# EAGLE design rpi-zero-psu (EAGLE 7.7.0)
CREVISION: 1A; DESIGNER: Joo Aun Saw
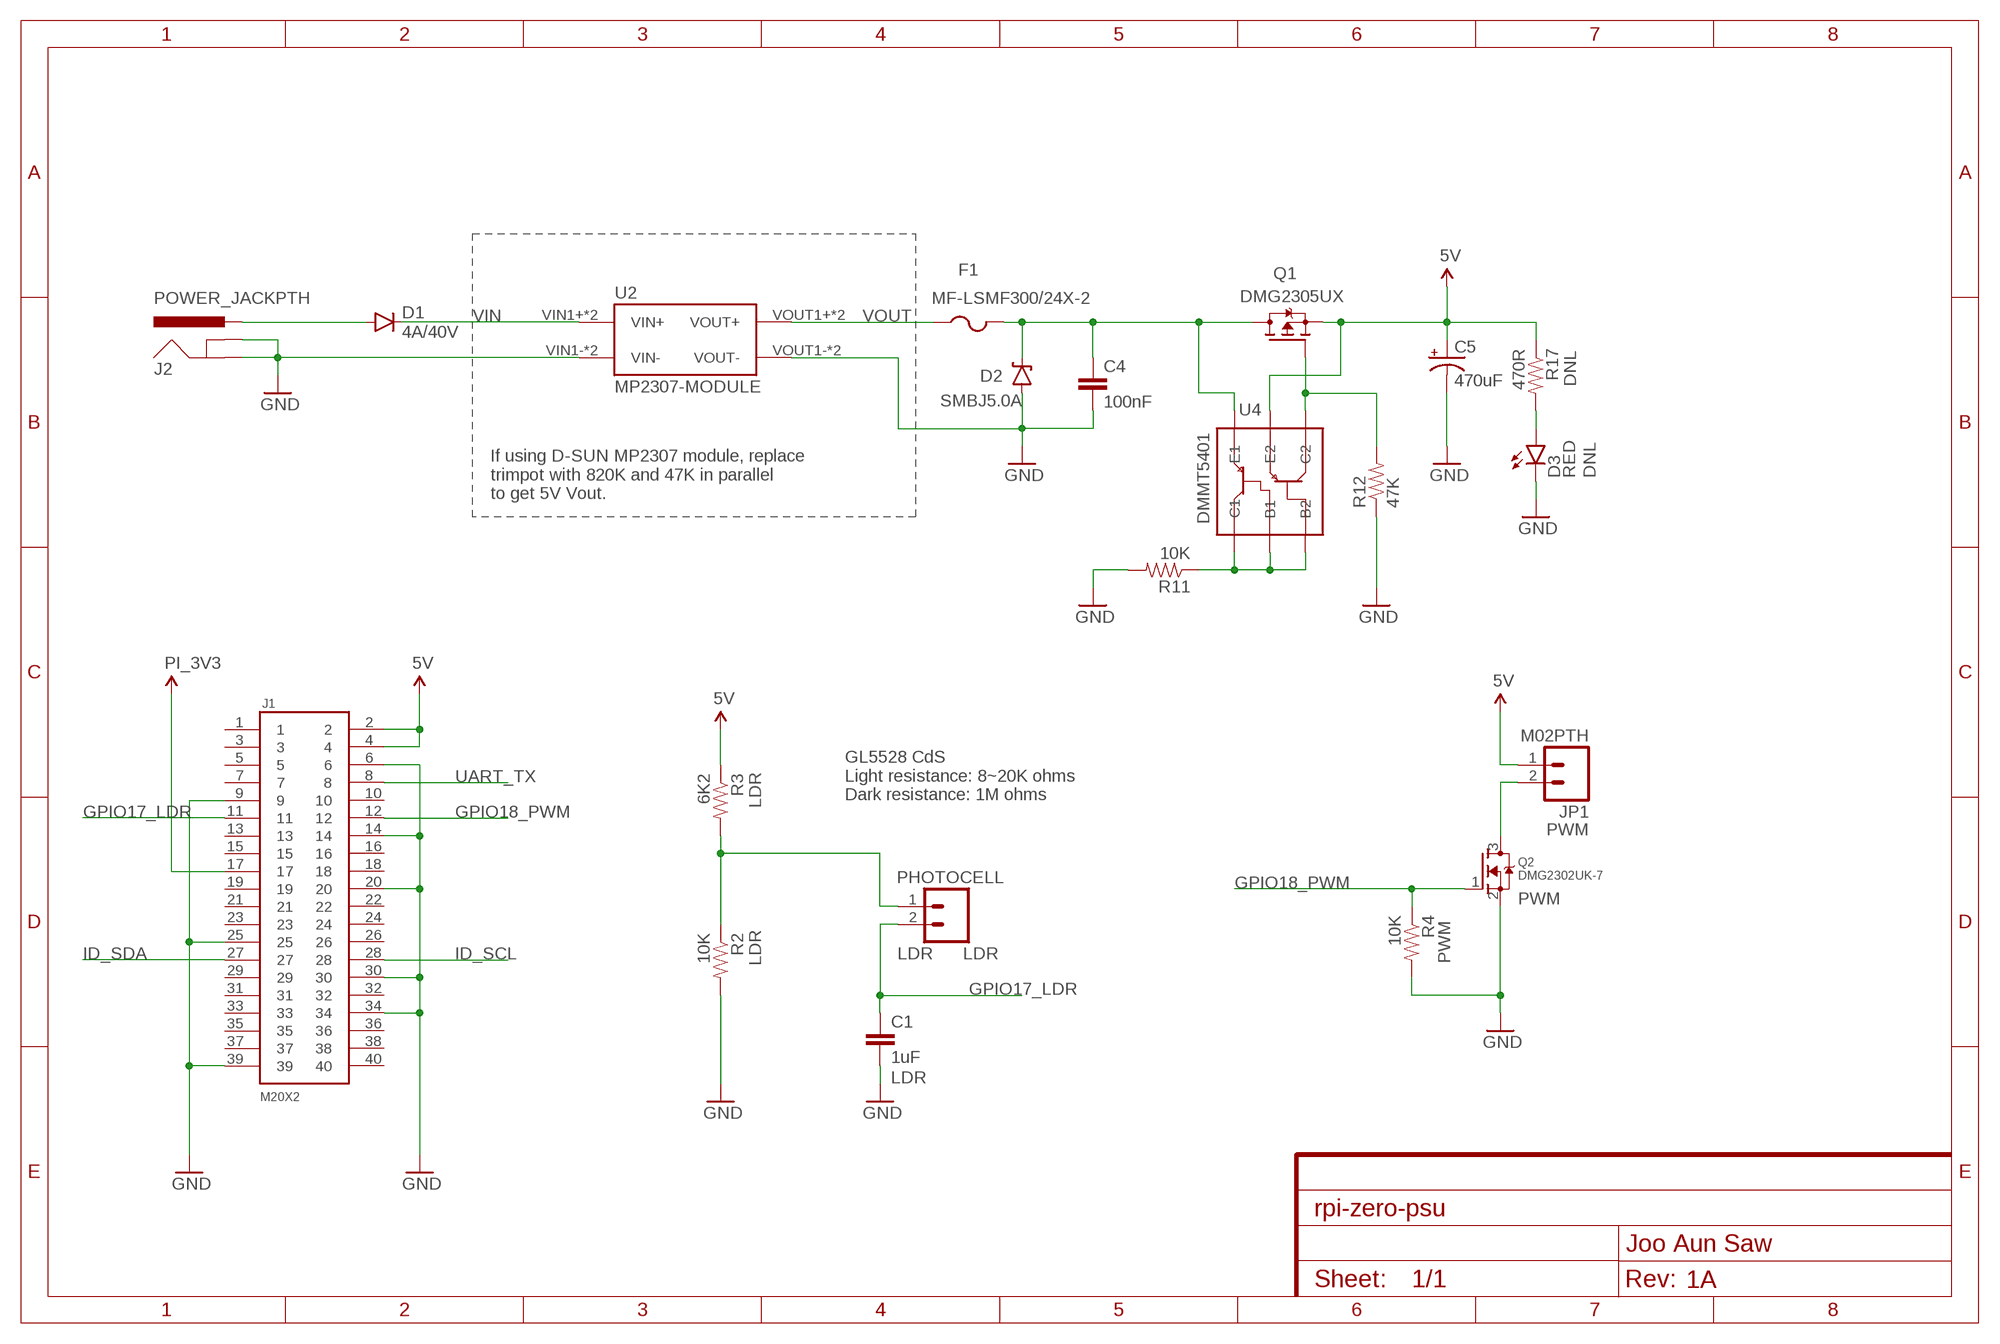
[diagram p0: schematic, sheet 1]

## Parts
C1  1uF  CAP0805  [0805]
C4  100nF  CAP0805  [0805]
C5  470uF  CAP_POLF  [PANASONIC_F]
D1  4A/40V  DIODEES3J  [SMC]
D2  SMBJ5.0A  DIODE-ZENERSMB  [SMB-DIODE]
D3  RED  LED-RED1206  [LED-1206]
F1  MF-LSMF300/24X-2  PTCFUSE-2920  [2920]
J1  M20X2  [2X20]
J2  POWER_JACKPTH  [POWER_JACK_PTH]
JP1  M02PTH  [1X02]
LDR  PHOTOCELL  M021X02_NO_SILK  [1X02_NO_SILK]
Q1  DMG2305UX  MOSFET-P  [SOT-23]
Q2  DMG2302UK-7  MOSFET-NREFLOW  [SOT23]
R2  10K  RESISTOR0805-RES  [0805]
R3  6K2  RESISTOR0805-RES  [0805]
R4  10K  RESISTOR0805-RES  [0805]
R11  10K  RESISTOR0805-RES  [0805]
R12  47K  RESISTOR0805-RES  [0805]
R17  470R  RESISTOR0805-RES  [0805]
U2  MP2307-MODULE  DC-DC-MODULEMP2307-MODULE  [MP1584EN-MODULE]
U4  DMMT5401  DMMT5401SOT  [SOT23-6]

## Nets
3.3V: J1.17 ; supply symbol labelled PI_3V3
5V: C5.+ J1.2 J1.4 JP1.1 Q1.2(S) R3.1 R17.1 U4.5(E2)
GND: C1.2 C4.2 C5.- D2.A D3.C J1.6 J1.9 J1.14 J1.20 J1.25 J1.30 J1.34 J1.39 J2.GND J2.GNDBREAK Q2.2(S) R2.2 R4.2 R11.2 R12.1 U2.VIN1-(VIN-) U2.VIN2-(VIN-) U2.VOUT1-(VOUT-) U2.VOUT2-(VOUT-)
GPIO17_LDR: C1.1 J1.11 LDR.2
GPIO18_PWM: J1.12 Q2.1(G) R4.1
ID_SCL: J1.28
ID_SDA: J1.27
N$1: JP1.2 Q2.3(D)
N$2: LDR.1 R2.1 R3.2
N$3: D3.A R17.2
N$5: D1.A J2.PWR
N$12: C4.1 D2.C F1.2 Q1.3(D) U4.6(E1)
N$13: R11.1 U4.1(C1) U4.2(B1) U4.3(B2)
N$15: Q1.1(G) R12.2 U4.4(C2)
UART_TX: J1.8
VIN: D1.C U2.VIN1+(VIN+) U2.VIN2+(VIN+)
VOUT: F1.1 U2.VOUT1+(VOUT+) U2.VOUT2+(VOUT+)
Unconnected: J1.1 J1.3 J1.5 J1.7 J1.10 J1.13 J1.15 J1.16 J1.18 J1.19 J1.21 J1.22 J1.23 J1.24 J1.26 J1.29 J1.31 J1.32 J1.33 J1.35 J1.36 J1.37 J1.38 J1.40

## Notes on the sheet
- If using D-SUN MP2307 module, replace
  trimpot with 820K and 47K in parallel
  to get 5V Vout.
- GL5528 CdS
  Light resistance: 8~20K ohms
  Dark resistance: 1M ohms

## Library data of the parts
C1 = SparkFun-Passives:CAP: Capacitor Standard 0603 ceramic capacitor, and 0.1" leaded capacitor.; DIGIKEY: 311-1456-1-ND; LDR: 1; MOUSER: 603-CC805KKX7R8BB105; PARTNO: CC0805KKX7R8BB105
C4 = SparkFun-Passives:CAP: Capacitor Standard 0603 ceramic capacitor, and 0.1" leaded capacitor.; DIGIKEY: 478-1395-1-ND; MOUSER: 581-08055C104K; PARTNO: 08055C104KAT2A
C5 = custom:CAP_POL: Capacitor Polarized These are standard SMD and PTH capacitors. Normally 10uF, 47uF, and 100uF in electrolytic and tantalum varieties. Always verify the external diameter of the through hole cap, it varies with capacity, voltage, and manufacturer. The EIA devices should be standard.; ALT_PARTNO: EEE-1CA471UP; DIGIKEY: 732-6443-1-ND; MOUSER: 710-875115150005; PARTNO: 875115150005
D1 = SparkFun-DiscreteSemi:DIODE: Diode These are standard reverse protection diodes and small signal diodes. SMA package can handle up to about 1A. SOD-323 can handle about 200mA. What the SOD-323 package when ordering, there are some mfgs out there that are 5-pin packages.; DIGIKEY: MBRS340T3GOSCT-ND; MOUSER: 863-MBRS340T3G; PARTNO: MBRS340T3G; PROD_ID: DIO-12441; VALUE: 3A/600V
D2 = custom:DIODE-ZENER: Zener Diode Production Part - 8199 3.4V Zener Voltage; DIGIKEY: SMBJ5.0ALFCT-ND; MOUSER: 576-SMBJ5.0A; PARTNO: SMBJ5.0A
D3 = SparkFun-LED:LED-RED: Assorted Red LEDs LilyPad 1206- DIO-09912 1206- DIO-00809 0603- DIO-00819; DIGIKEY: 160-1167-1-ND; DNL: 1; MOUSER: 859-LTST-C150CKT; PARTNO: LTST-C150CKT; PROD_ID: DIO-00809
F1 = custom:PTCFUSE: PTC fuses, resettable thermistors; DIGIKEY: MF-LSMF300/24X-2CT-ND; MOUSER: 652-MF-LSMF300/24X-2; PARTNO: MF-LSMF300/24X-2
J1 = custom:M20X2; DIGIKEY: S7123-ND; MOUSER: 517-929975-01-20; PARTNO: PPPC202LFBN-RC
J2 = custom:POWER_JACK: Power Jack This is the standard 5.5mm barrel jack for power. The PTH is the most common, proven, reliable, footprint. The Slot footprint only works if the mill layer is transmitted to the PCB fab house so be warned. Mating wall wart : TOL-00298 (and others); DIGIKEY: CP-002A-ND; MOUSER: 490-PJ-002A; PARTNO: PJ-002A; PROD_ID: CONN-08197
JP1 = SparkFun-Connectors:M02: Standard 2-pin 0.1" header. Use with - straight break away headers ( PRT-00116) - right angle break away headers (PRT-00553) - swiss pins (PRT-00743) - machine pins (PRT-00117) - female headers (PRT-00115) Molex polarized connector foot print use with: PRT-08233 with associated crimp pins and housings. 2.54_SCREWTERM for use with PRT-10571. 3.5mm Screw Terminal footprints for PRT-08084 5mm Screw Terminal footprints for use with PRT-08432; MOUSER: 571-826936-2; PARTNO: 826936-2; PWM: 1
LDR = SparkFun-Connectors:M02: Standard 2-pin 0.1" header. Use with - straight break away headers ( PRT-00116) - right angle break away headers (PRT-00553) - swiss pins (PRT-00743) - machine pins (PRT-00117) - female headers (PRT-00115) Molex polarized connector foot print use with: PRT-08233 with associated crimp pins and housings. 2.54_SCREWTERM for use with PRT-10571. 3.5mm Screw Terminal footprints for PRT-08084 5mm Screw Terminal footprints for use with PRT-08432; LDR: 1
Q1 = custom:MOSFET-P; DIGIKEY: DMG2305UX-7DICT-ND; MOUSER: 621-DMG2305UX-7; PARTNO: DMG2305UX-7
Q2 = custom:MOSFET-N: N-Channel Mosfet 2N7002E - 60V 260mA SOT23 [Digikey: 2N7002ET1GOSTR-ND] - REEL BSH103 - 30V 850mA SOT23 [Digikey: 568-5013-1-ND] RE1C002UNTCL - 20V 200mA SC-89 [Digikey: RE1C002UNTCLCT-ND]; DIGIKEY: DMG2302UK-7DICT-ND; MOUSER: 621-DMG2302UK-7; PARTNO: DMG2302UK-7; PWM: 1
R2 = SparkFun-Passives:RESISTOR: Resistor Basic schematic elements and footprints for 0603, 1206, and PTH resistors.; DIGIKEY: 311-10KARCT-ND; LDR: 1; MOUSER: 603-RC0805JR-0710KL; PARTNO: RC0805JR-0710KL
R3 = SparkFun-Passives:RESISTOR: Resistor Basic schematic elements and footprints for 0603, 1206, and PTH resistors.; DIGIKEY: 311-6.2KARCT-ND; LDR: 1; MOUSER: 603-RC0805JR-076K2L; PARTNO: RC0805JR-076K2L
R4 = SparkFun-Passives:RESISTOR: Resistor Basic schematic elements and footprints for 0603, 1206, and PTH resistors.; DIGIKEY: 311-10KARCT-ND; MOUSER: 603-RC0805JR-0710KL; PARTNO: RC0805JR-0710KL; PWM: 1
R11 = SparkFun-Passives:RESISTOR: Resistor Basic schematic elements and footprints for 0603, 1206, and PTH resistors.; DIGIKEY: 311-10KARCT-ND; MOUSER: 603-RC0805JR-0710KL; PARTNO: RC0805JR-0710KL
R12 = SparkFun-Passives:RESISTOR: Resistor Basic schematic elements and footprints for 0603, 1206, and PTH resistors.; DIGIKEY: 311-47.0KCRCT-ND; MOUSER: 603-RC0805FR-0747KL; PARTNO: RC0805FR-0747KL
R17 = SparkFun-Passives:RESISTOR: Resistor Basic schematic elements and footprints for 0603, 1206, and PTH resistors.; DIGIKEY: 311-470ARCT-ND; DNL: 1; MOUSER: 603-RC0805JR-07470RL; PARTNO: RC0805JR-07470RL
U2 = custom:DC-DC-MODULE: DC-DC buck converter; ALT_PARTNO: IM130731001; DIGIKEY: 106990005-ND; MOUSER: 713-106990005; PARTNO: 106990005; VENDOR: D-SUN
U4 = custom:DMMT5401: Matched PNP Small Signal Transistor.; DIGIKEY: DMMT5401-FDICT-ND; MOUSER: 621-DMMT5401-7-F; PARTNO: DMMT5401-7-F

## Board
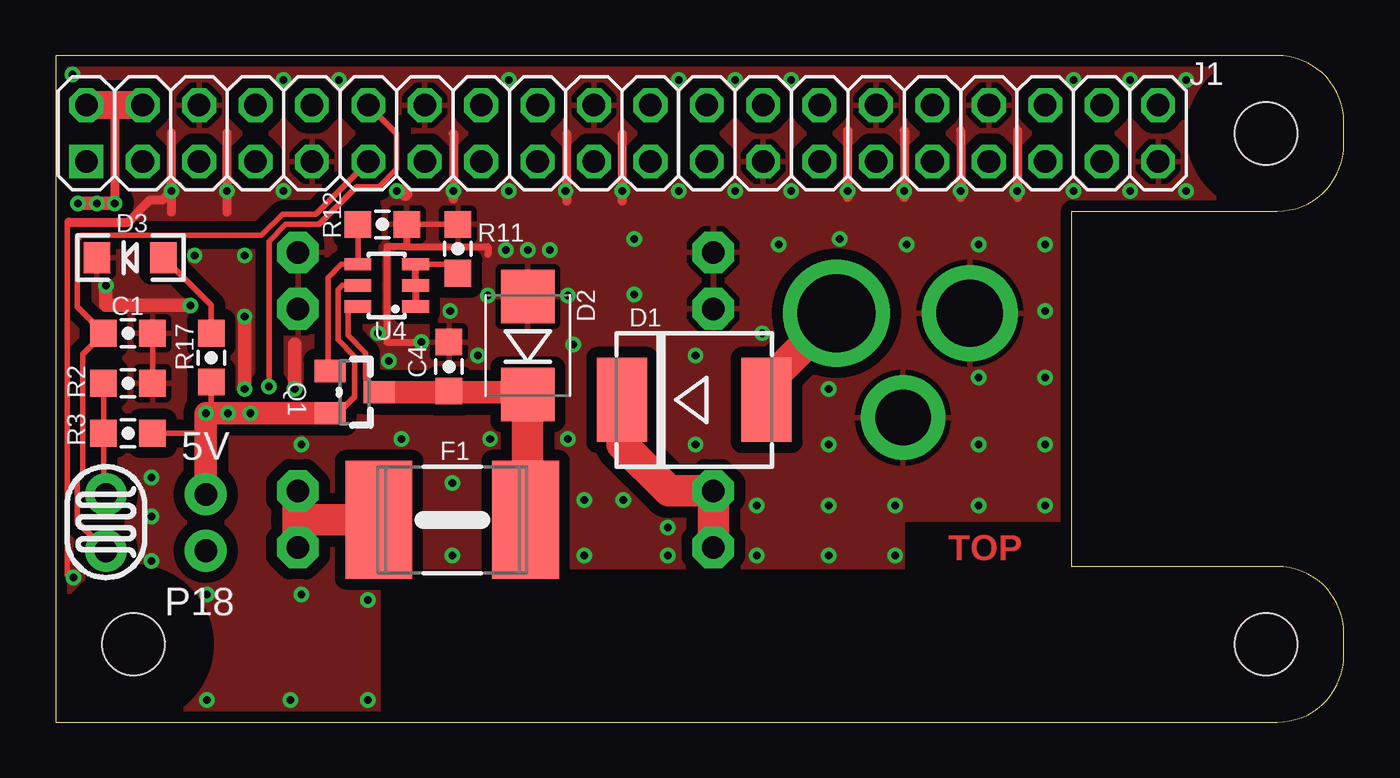
[diagram p1: board, top side]
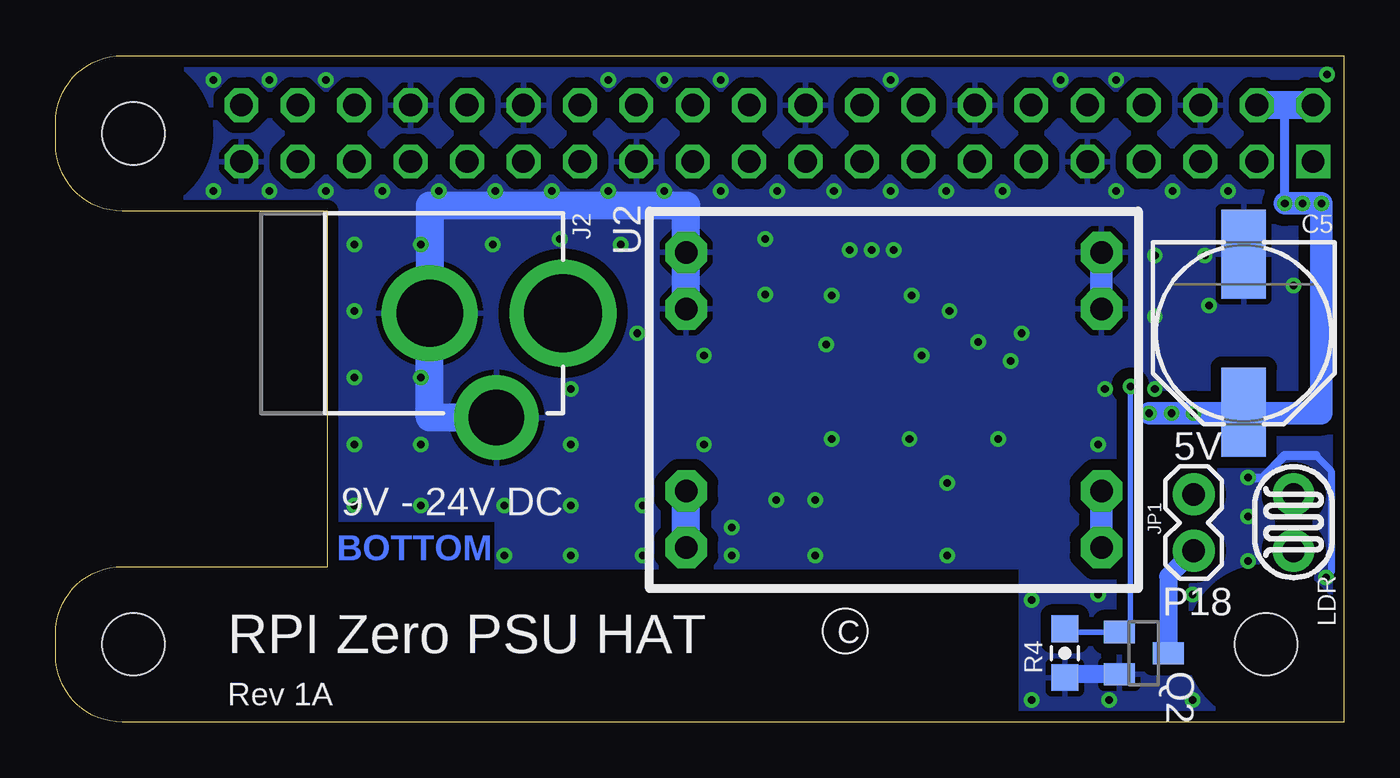
[diagram p2: board, bottom side, seen from below]

Size 58 x 30 mm. Coordinates in mm from the lower left corner, seen from the top.
Outline: 0,0 55,0 arc90 58,3 58,4 arc90 55,7 45.75,7 45.75,23 55,23 arc90 58,26 58,27 arc90 55,30 0,30 0,0
Copper layers (1*16): Top 0.0356mm / dielectric 1.5011mm / Bottom 0.0356mm
Design rules "oshpark-2layer *": minimum track width 6mil, minimum drill 13mil, track to track 6mil, track to pad 6mil, pad to pad 6mil, via to via 6mil, smd to smd 6mil, copper to edge 15mil, drill to drill 6mil, minimum pad ring 7mil, minimum via ring 7mil, stop-mask expansion 2mil, vias tented up to drill 100mil, thermal gap 10mil
Holes 2.8 mm at 54.5,26.5 54.5,3.5 3.5,3.5
tRestrict: area 53,24.9 to 56,28.1; area 53,1.9 to 56,5; area 1.9,1.9 to 5.1,5
bRestrict: area 53,1.9 to 56,5; area 53,24.9 to 56,28.1; area 1.9,1.9 to 5.1,5

### Footprints (pad centres in the part's own frame; a part is rotated, then mirrored left to right if it is on the bottom)
0805 = smd 1.2 x 1.2: 1 -1.1,0; 2 1.1,0
PANASONIC_F = smd 4 x 2: + 3.55,0; - -3.55,0
SMC = smd 2.25 x 3.79: A 3.25,0; C -3.25,0
SMB-DIODE = smd 2.4 x 2.4: A 2.2,0; C -2.2,0
LED-1206 = smd 1.2 x 1.4: A -1.5,0; C 1.5,0
2920 = smd 3 x 5.3: 1 -3.3,0; 2 3.3,0
2X20 = drill 1.016 square: 1 -24.13,-1.27 | drill 1.016 octagon: 2 -24.13,1.27; 3 -21.59,-1.27; 4 -21.59,1.27; 5 -19.05,-1.27; 6 -19.05,1.27; 7 -16.51,-1.27; 8 -16.51,1.27; 9 -13.97,-1.27; 10 -13.97,1.27; 11 -11.43,-1.27; 12 -11.43,1.27; 13 -8.89,-1.27; 14 -8.89,1.27; 15 -6.35,-1.27; 16 -6.35,1.27; 17 -3.81,-1.27; 18 -3.81,1.27; 19 -1.27,-1.27; 20 -1.27,1.27; 21 1.27,-1.27; 22 1.27,1.27; 23 3.81,-1.27; 24 3.81,1.27; 25 6.35,-1.27; 26 6.35,1.27; 27 8.89,-1.27; 28 8.89,1.27; 29 11.43,-1.27; 30 11.43,1.27; 31 13.97,-1.27; 32 13.97,1.27; 33 16.51,-1.27; 34 16.51,1.27; 35 19.05,-1.27; 36 19.05,1.27; 37 21.59,-1.27; 38 21.59,1.27; 39 24.13,-1.27; 40 24.13,1.27
POWER_JACK_PTH = drill 3 pad 4.318: GND 0,7.7 | drill 2.5 pad 3.81: GNDBREAK 4.7,10.7 | drill 3.5 pad 4.8: PWR 0,13.7
1X02 = drill 1.016 pad 1.88: 1 0,0; 2 2.54,0
1X02_NO_SILK = drill 1.016 pad 1.88: 1 0,0; 2 2.54,0
SOT-23 = smd 1 x 1.4: 1 -0.95,-1.1; 2 0.95,-1.1; 3 0,1.1
SOT23 = smd 1 x 1.4: 1 -0.95,-1.1; 2 0.95,-1.1; 3 0,1.1
MP1584EN-MODULE = drill 1.016 pad 1.88 octagon: VIN1+ -9.35,-6.64; VIN1- -9.35,6.64; VIN2+ -9.35,-4.1; VIN2- -9.35,4.1; VOUT1+ 9.35,-6.64; VOUT1- 9.35,6.64; VOUT2+ 9.35,-4.1; VOUT2- 9.35,4.1
SOT23-6 = smd 0.55 x 1.2: 1 -0.95,-1.3; 2 0,-1.3; 3 0.95,-1.3; 4 0.95,1.3; 5 0,1.3; 6 -0.95,1.3

### Placement (x,y rotation side)
C1  3.25,17.5 0 top
C4  17.7,16 90 top
C5  4.5,17.5 270 bottom
D1  28.75,14.5 0 top
D2  21.25,16.95 90 top
D3  3.35,20.9 180 top
F1  17.85,9.1 0 top
J1  25.5,26.5 0 top
J2  48.85,18.4 270 bottom
JP1  6.75,10.25 270 bottom
LDR  2.25,10.25 270 bottom
Q1  13.45,14.85 270 top
Q2  9,3.1 270 bottom
R2  3.25,15.25 0 top
R3  3.25,13 180 top
R4  12.55,3.1 270 bottom
R11  18.1,21.3 90 top
R12  14.7,22.4 180 top
R17  7,16.4 90 top
U2  20.25,14.5 0 bottom
U4  14.9,19.65 90 top

### Tracks (layer width: path | path; a pad name or v marks a point on that pad's centre or on a via)
5V  (via drill 0.34)
  Top 0.254: R17.1 7,13.9 v6.75,13.9 6.75,13 R3.1 | U4.5 12.9,19.65 12.7,19.45 12.7,17.2 13.45,16.45 13.45,14.65 12.7,13.9 Q1.2
  Top 0.406: J1.4 2.65,27.77 v2.65,23.35
  Top 0.61: v1,23.35 v1.85,23.35 v2.65,23.35
  Top 1.016: Q1.2 v6.75,13.9 JP1.1
  Top 1.27: J1.4 J1.2 1.75,27.75
  Bottom 0.406: v2.65,23.35 2.65,27.75
  Bottom 1.016: v8.75,13.9 v7.75,13.9 v6.75,13.9 4.5,13.9 | 4.5,13.9 C5.+ | v2.65,23.35 v1,23.35 1,13.9 4.5,13.9
  Bottom 1.27: J1.2 J1.4
GND  (via drill 0.34)
  Top 0.254: R12.1 R11.2 | R2.2 C1.2 | 0.6,22.5 0.51,22.46 0.51,6.63 0.64,6.5 v0.8,6.5
  Top 0.305: R12.1 15.8,21.4 | 15.8,21.4 14.9,21.4 14.9,17.1 16.4,17.1 | 15.8,21.4 19.45,21.4 19.45,21.05
  Top 0.406: 17.9,26.48 17.9,23.55 | 7.7,26.52 7.7,22.95 | 23,26.47 23,23.45 | 5.2,26.52 v5.2,23.9 | v5.2,23.9 5.2,22.95 | 35.65,26.62 35.65,23.6 | 40.75,26.62 40.75,23.6 | 38.2,26.62 38.2,23.6 | 43.3,26.62 43.3,23.6 | 25.5,26.47 25.5,23.45 | 0.6,22.5 3.25,22.5 4.25,23.5 4.8,23.5 v5.2,23.9
  Top 0.61: v6.05,18.75 2.25,18.75 v2.25,19.65 | v8.5,15 v8.5,18.25 | v10.75,15 10.75,17 | v15.36,23.9 15.6,23.9 15.75,23.75
  Bottom 0.305: 1.25,12 0.56,11.31 0.56,6.74 v0.8,6.5
  Bottom 0.406: v4.3,11 3.65,11 2.65,12 1.25,12
  Bottom 0.813: Q2.2 12.55,2.15 R4.2
  Bottom 1.016: U2.VOUT1- U2.VOUT2-
  Bottom 1.27: U2.VIN2- U2.VIN1- 29.6,23.25 41.15,23.25 J2.GND 41.15,13.7 J2.GNDBREAK
  other vias: 7.7,23.9 10.25,23.9 17.9,23.9 20.4,23.9 22.95,23.9 33.12,23.9 6.25,21 8.5,21 30.58,23.9 28.04,23.9 25.5,23.9 35.66,23.9 38.2,23.9 40.74,23.9 43.28,23.9 45.82,23.9 48.36,23.9 50.9,23.9 4.3,7.25 4.3,9.25 6.8,5.75 6.8,1 14.05,1 10.55,1 14.05,5.5 11.05,5.75 14.5,17.5 15,16.25 16.45,17.1 17.75,18.5 21.25,21.25 20.25,21.25 22.25,21.25 19.45,19.2 23.05,19.2 19,16.5 11.05,12.5 17.85,7.5 17.85,10.75 19.55,12.75 15.55,12.75 23.05,12.75 23.8,7.5 27.55,7.5 27.55,8.75 23.8,10 25.55,10 23.3,17 31.55,7.5 37.8,7.5 34.8,7.5 26.05,19.25 26.05,21.75 31.55,9.75 37.8,9.75 34.8,9.75 44.55,9.75 41.55,9.75 44.55,12.5 44.55,15.5 41.55,12.5 41.55,15.5 44.55,18.5 44.55,21.5 41.55,21.5 38.3,21.5 35.3,21.75 32.55,21.5 31.8,17.5 34.8,12.5 34.8,15 28.8,12.5 28.8,16.5 50.9,28.9 45.82,28.9 30.58,28.9 10.25,28.9 0.75,29.15 20.4,28.9 28.04,28.9 33.12,28.9 48.36,28.9 12.75,28.9
  pour Bottom (isolate 0.5): 0,0 14.5,0 14.5,7 45.75,7 45.75,23 55,23 arc90 58,26 58,27 arc90 55,30 0,30
  pour Top (isolate 0.5): 0,30 0,0 14.5,0 14.5,7 45.75,7 45.75,23 55,23 arc90 58,26 58,27 arc90 55,30
GPIO17_LDR
  Top 0.254: J1.11 11.69,22.85 10.2,22.85 9.25,21.9 1.15,21.9 0.95,21.7 0.95,18.7 C1.1 1.2,16.55 1.2,11.2 0.95,10.95 0.95,9.01 LDR.2
GPIO18_PWM  (via drill 0.34)
  Top 0.254: J1.12 15.35,26.49 15.35,24.9 14.55,24.1 13.55,24.1 11.85,22.4 10.35,22.4 9.6,21.65 v9.6,15.1
  Bottom 0.254: v9.6,15.1 9.6,4.55 Q2.1 12.4,4.05 R4.1
N$1
  Bottom 0.813: JP1.2 7.9,6.56 Q2.3
N$2
  Top 0.254: R2.1 R3.2 2.15,10.35 LDR.1
N$3
  Top 0.254: R17.2 7,18.75 D3.A
N$4
  cutout Top: 45.5,9 45.5,6.75 38.25,6.75 38.25,9
N$5
  Top 1.422: J2.PWR 32,15.25 D1.A
N$6
  cutout Bottom: 45.5,9 45.5,6.75 38.25,6.75 38.25,9
N$12
  Top 0.254: U4.6 13.15,18.7 13.15,17.4 13.95,16.6 13.95,15.45 Q1.3
  Top 1.016: Q1.3 17.75,14.85 | 17.75,14.85 21.25,14.85 D2.C | C4.1 17.75,14.9 17.75,14.85
  Top 1.422: D2.C 21.25,9.1 F1.2
N$13
  Top 0.254: U4.3 18.1,20.6 R11.1
  Top 0.305: U4.1 U4.2 U4.3
N$15
  Top 0.254: Q1.1 12.25,15.8 12.25,20 12.85,20.6 U4.4 R12.2 | R12.2
VIN
  Top 1.422: U2.VIN1+ 29.6,10.5 29.5,10.5 29.4,10.4 27.6,10.4 25.5,12.5 D1.C
  Bottom 1.27: U2.VIN1+ U2.VIN2+
VOUT
  Top 1.422: F1.1 14.1,9.1 10.9,9.1 | 10.9,9.1 U2.VOUT1+ | U2.VOUT2+ 10.9,9.1
  Bottom 1.016: U2.VOUT2+ U2.VOUT1+

### Text on the board
Top: TOP
Bottom: BOTTOM
tPlace: 5V | P18
bPlace: 5V | 9V - 24V DC | P18 | C | RPI Zero PSU HAT | Rev 1A